# Altium schematic sheet LIMIT_SWITCH.schdoc
size 283 x 173 mm
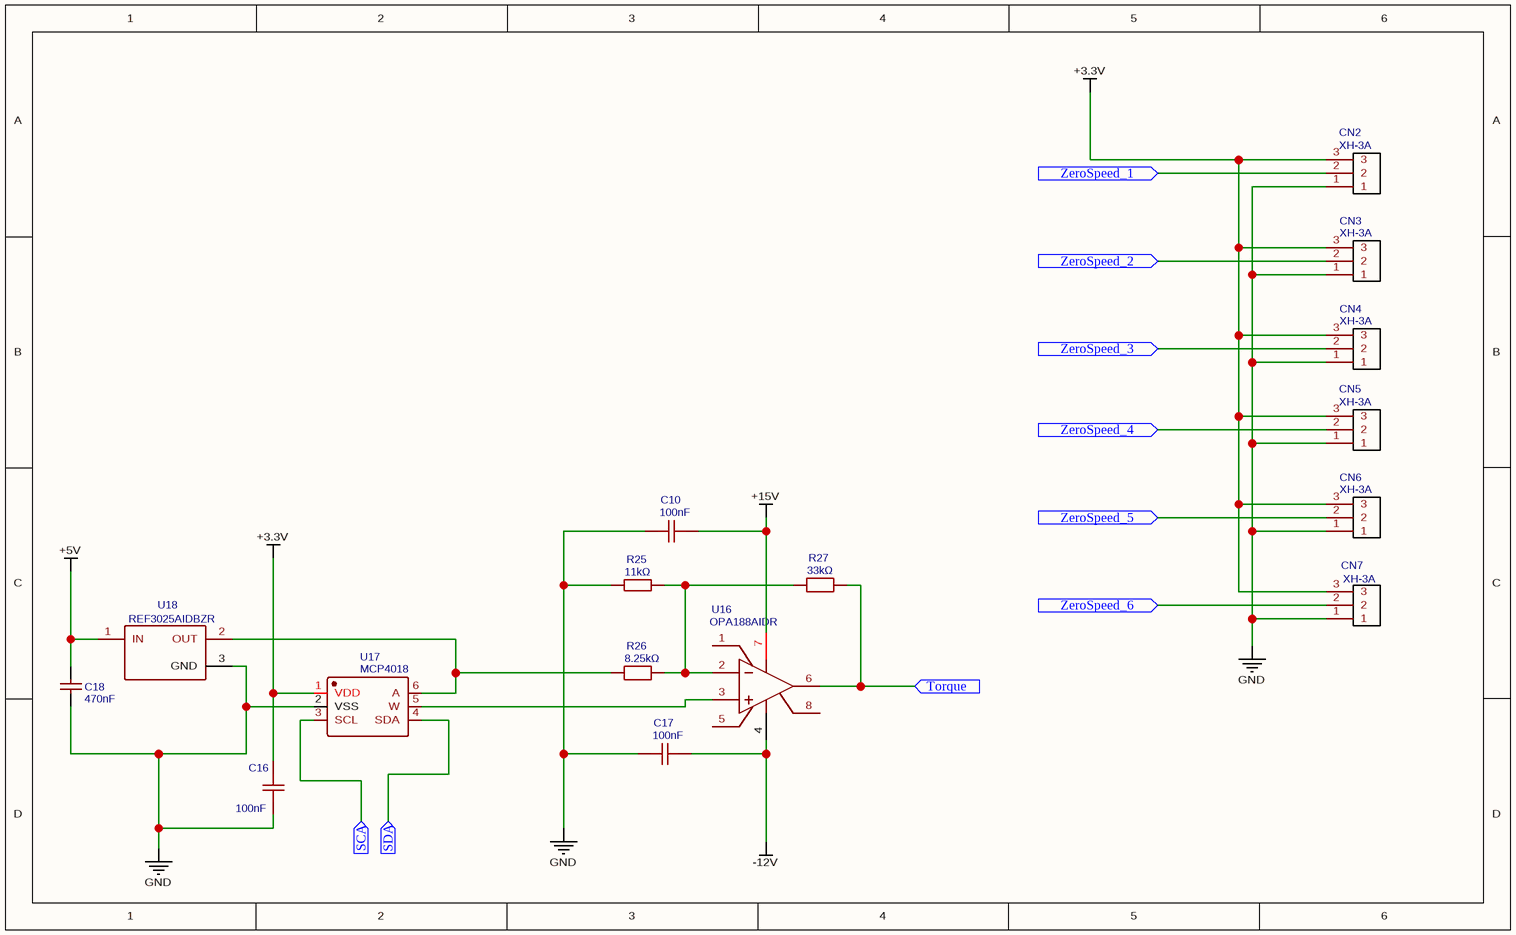
[diagram p0: LIMIT_SWITCH.schdoc]

## Parts
C10  100nF  [C0805]
C16  100nF  [C0805]
C17  100nF  [C0805]
C18  470nF  [C0603]
CN2  XH-3A  [CONN-TH_XH-3A]
CN3  XH-3A  [CONN-TH_XH-3A]
CN4  XH-3A  [CONN-TH_XH-3A]
CN5  XH-3A  [CONN-TH_XH-3A]
CN6  XH-3A  [CONN-TH_XH-3A]
CN7  XH-3A  [CONN-TH_XH-3A]
R25  11kΩ  [R0603]
R26  8.25kΩ  [R0603]
R27  33kΩ  [R0603]
U16  OPA188AIDR  [SOIC-8_L4.9-W3.9-P1.27-LS6.0-BL]
U17  MCP4018  [SC-70-6_L2.2-W1.3-P0.65-LS2.1-BR]
U18  REF3025AIDBZR  [SOT-23-3_L2.9-W1.6-P1.90-LS2.8-BR]

## Ports
SCA (in), SDA (in), Torque (in), ZeroSpeed_1 (in), ZeroSpeed_2 (in), ZeroSpeed_3 (in), ZeroSpeed_4 (in), ZeroSpeed_5 (in), ZeroSpeed_6 (in)

## Nets
+3.3V: C16.2 CN2.3 CN3.3 CN4.3 CN5.3 CN6.3 CN7.3 U17.1(VDD)
+5V: C18.1 U18.1(IN)
+15V: C10.1 U16.7(V+)
-12V: C17.2 U16.4(V-)
GND: C10.2 C16.1 C17.1 C18.2 CN2.1 CN3.1 CN4.1 CN5.1 CN6.1 CN7.1 R25.1 U17.2(VSS) U18.3(GND)
SCA: U17.3(SCL) ; port SCA
SDA: U17.4(SDA) ; port SDA
Torque: R27.2 U16.6(OUT) ; port Torque
ZeroSpeed_1: CN2.2 ; port ZeroSpeed_1
ZeroSpeed_2: CN3.2 ; port ZeroSpeed_2
ZeroSpeed_3: CN4.2 ; port ZeroSpeed_3
ZeroSpeed_4: CN5.2 ; port ZeroSpeed_4
ZeroSpeed_5: CN6.2 ; port ZeroSpeed_5
ZeroSpeed_6: CN7.2 ; port ZeroSpeed_6
NetR25_2: R25.2 R26.1 R27.1 U16.2(IN-)
NetR26_2: R26.2 U17.6(A) U18.2(OUT)
NetU16_3: U16.3(IN+) U17.5(W)

Not connected (* = marked no-connect by the designer): U16 1(NC) 5(NC) 8(NC)

## Library data of the parts
C10 C16 C17 = 100nF: Manufacturer: YAGEO; Manufacturer Part: CC0805KRX7R8BB104; nameAlias: Capacitance; Contributor: LCSC; Supplier: LCSC; Supplier Part: C519981; JLCPCB Part Class: Extended Part; spicePre: C; spiceSymbolName: CC0805KRX7R8BB104
C18 = 470nF: Manufacturer: YAGEO(国巨); Manufacturer Part: CC0603KRX7R7BB474; nameAlias: Value; Supplier: LCSC; Supplier Part: C106851; JLCPCB Part Class: Extended Part; link: https://lcsc.com/eda_search?q=C106851&%26type=1&ref=editor; spicePre: C; spiceSymbolName: CC0603KRX7R7BB474
CN2-CN7 = XH-3A: Manufacturer: BOOMELE(博穆精密); Supplier: LCSC; Manufacturer Part: XH-3A; Supplier Part: C2316; JLCPCB Part Class: Extended Part; spicePre: C; spiceSymbolName: XH-3A
R25 = 11kΩ: Manufacturer: Viking(光颉); Manufacturer Part: ARG03FTC1102; nameAlias: Value; Contributor: LCSC; Supplier: LCSC; Supplier Part: C217703; JLCPCB Part Class: Extended Part; link: https://lcsc.com/eda_search?q=C217703&%26type=1&ref=editor; spicePre: R; spiceSymbolName: ARG03FTC1102
R26 = 8.25kΩ: Manufacturer: YAGEO(国巨); Manufacturer Part: RT0603BRD078K25L; Contributor: LCSC; nameAlias: Value; Supplier: LCSC; Supplier Part: C705798; JLCPCB Part Class: Extended Part; link: https://lcsc.com/eda_search?q=C705798&%26type=1&ref=editor; spicePre: R; spiceSymbolName: RT0603BRD078K25L
R27 = 33kΩ: Manufacturer: YAGEO(国巨); Manufacturer Part: RT0603BRD0733KL; Contributor: LCSC; nameAlias: Value; Supplier: LCSC; Supplier Part: C705768; JLCPCB Part Class: Extended Part; link: https://lcsc.com/eda_search?q=C705768&%26type=1&ref=editor; spicePre: R; spiceSymbolName: RT0603BRD0733KL
U16 = OPA188AIDR: Manufacturer: TI(德州仪器); Contributor: LCSC; Supplier: LCSC; Supplier Part: C85166; Manufacturer Part: OPA188AIDR; JLCPCB Part Class: Extended Part; spicePre: U; spiceSymbolName: OPA188AIDR
U17 = MCP4018: Manufacturer: MICROCHIP(美国微芯); Manufacturer Part: MCP4018T-503E/LT; Contributor: LCSC; nameAlias: Value; Supplier: LCSC; Supplier Part: C145561; JLCPCB Part Class: Extended Part; spicePre: U; spiceSymbolName: MCP4018T-503E/LT
U18 = REF3025AIDBZR: Manufacturer: TI(德州仪器); Supplier: LCSC; Manufacturer Part: REF3025AIDBZR; Supplier Part: C11334; JLCPCB Part Class: Extended Part; link: https://lcsc.com/eda_search?q=C11334&%26type=1&ref=editor; spicePre: U; spiceSymbolName: REF3025AIDBZR